# EAGLE design NTcounterTX (EAGLE 9.5.2)
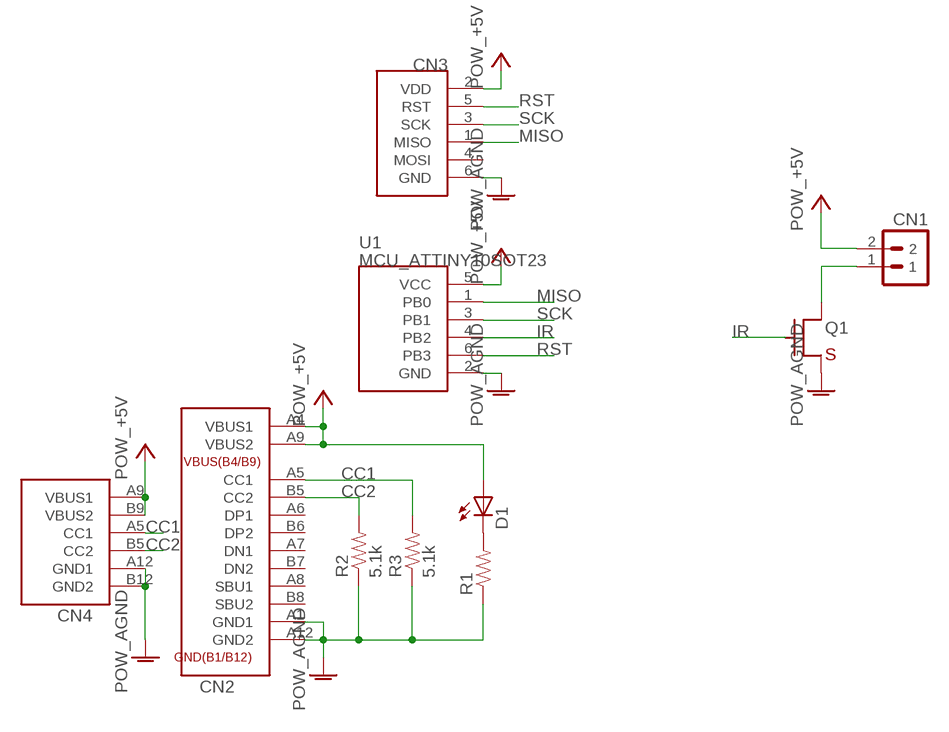
[diagram p0: schematic, sheet 1]

## Parts
CN1  CON_PINHD-1X2LOCK  [SPARKFUN_1X02_LOCK]
CN2  CON_USB-C-16TH  [USB-C_16P_TH]
CN3  CON_AVRISPTH  [2X03R]
CN4  CON_USB-C-6  [USB-C_6P]
D1  LED0603  [SPARKFUN_LED-0603]
Q1  TR_NMOS_IRLML6344  [SOT-23-3-2916]
R1  RES0603  [0603]
R2  5.1k  RES0603  [0603]
R3  5.1k  RES0603  [0603]
U1  MCU_ATTINY10SOT23  [SOT23-6]

## Nets
+5V: CN1.2 CN2.A4(VBUS1) CN2.A9(VBUS2) CN3.2(VDD) CN4.A9(VBUS1) CN4.B9(VBUS2) D1.A U1.5(VCC) ; supply symbol labelled POW_+5V
AGND: CN2.A1(GND1) CN2.A12(GND2) CN3.6(GND) CN4.A12(GND1) CN4.B12(GND2) Q1.2(S) R1.1 R2.1 R3.1 U1.2(GND) ; supply symbol labelled POW_AGND
CC1: CN2.A5(CC1) CN4.A5(CC1) R3.2
CC2: CN2.B5(CC2) CN4.B5(CC2) R2.2
IR: Q1.1(G) U1.4(PB2)
MISO: CN3.1(MISO) U1.1(PB0)
N$2: CN1.1 Q1.3(D)
N$3: D1.C R1.2
RST: CN3.5(RST) U1.6(PB3)
SCK: CN3.3(SCK) U1.3(PB1)
Unconnected: CN2.A6(DP1) CN2.A7(DN1) CN2.A8(SBU1) CN2.B6(DP2) CN2.B7(DN2) CN2.B8(SBU2) CN3.4(MOSI)

## Library data of the parts
CN1 = akita:CON_PINHD-1X2: Header 2 Standard 2-pin 0.1" header. Use with straight break away headers (SKU : PRT-00116), right angle break away headers (PRT-00553), swiss pins (PRT-00743), machine pins (PRT-00117), and female headers (PRT-00115). Molex polarized connector foot print use with SKU : PRT-08233 with associated crimp pins and housings.
CN2 = akita:CON_USB-C-16: USB Type-C, 16p with 8p dummy
CN3 = akita:CON_AVRISP: AVR ISP standard 2x3 connector
CN4 = akita:CON_USB-C-6: USB Type-C Receptacle, 6p (with 18p dummy), no D+/D-
D1 = akita:LED: LEDs Standard schematic elements and footprints for 5mm, 3mm, 1206, and 0603 sized LEDs. 5mm - Spark Fun Electronics SKU : COM-00529 (and others)
Q1 = akita:TR_NMOS_IRLML6344
R1-R3 = akita:RES: Resistor Basic schematic elements and footprints for 0603, 1206, and PTH resistors.
U1 = akita:MCU_ATTINY10

## Board
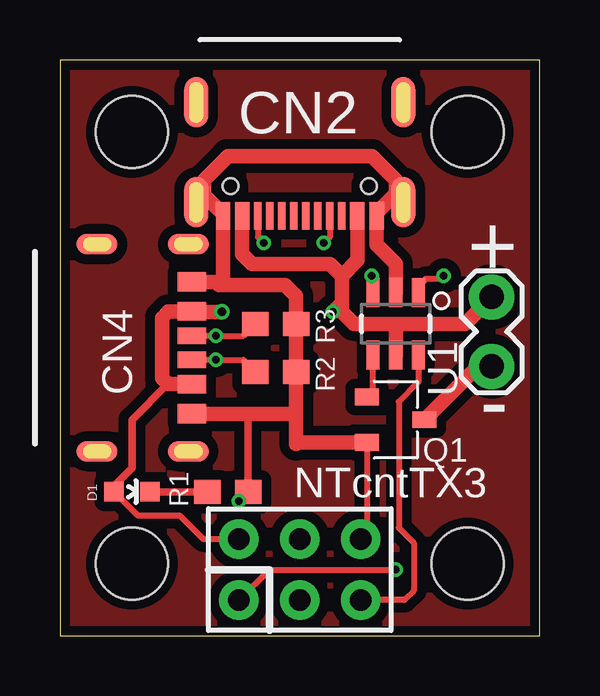
[diagram p1: board, top side]
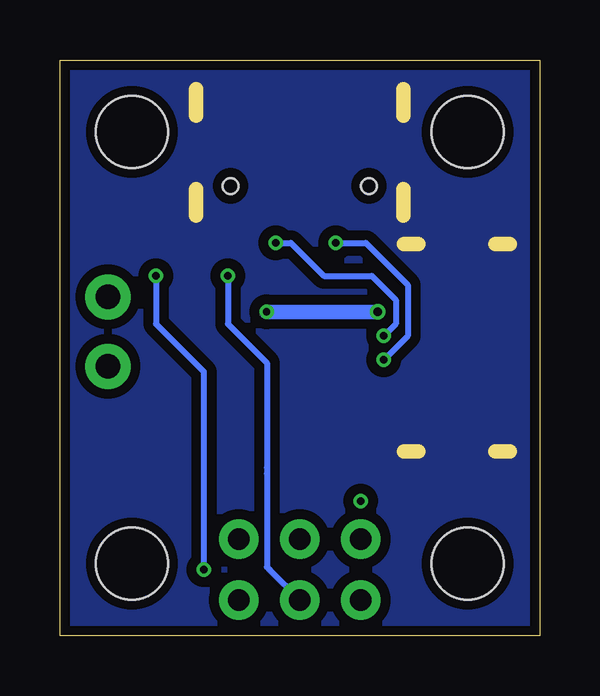
[diagram p2: board, bottom side, seen from below]

Size 20 x 24 mm. Coordinates in mm from the lower left corner, seen from the top.
Outline: 0,0 20,0 20,24 0,24 0,0
Copper layers (1*16): Top 0.035mm / dielectric 1.5mm / Bottom 0.035mm
Design rules "SeeedStudio_2layer_DRU_no_angle_20140221": minimum track width 6mil, minimum drill 12mil, track to track 6mil, track to pad 6mil, pad to pad 6mil, via to via 6mil, smd to smd 0mil, copper to edge 10mil, drill to drill 10mil, minimum pad ring 10mil, minimum via ring 6mil, stop-mask expansion 2mil, vias tented up to drill 100mil, thermal gap 10mil
Holes 3 mm at 3,3 17,3 17,21 3,21

### Footprints (pad centres in the part's own frame; a part is rotated, then mirrored left to right if it is on the bottom)
SPARKFUN_1X02_LOCK = drill 1.016 pad 1.88: 1 -0.178,0; 2 2.718,0
USB-C_16P_TH = smd 0.6 x 1.15: A1 -3.2,1; A4 -2.4,1; A9 2.4,1; A12 3.2,1 | smd 0.3 x 1.15: A5 -1.25,1; A6 -0.25,1; A7 0.25,1; A8 1.25,1; B5 1.75,1; B6 0.75,1; B7 -0.75,1; B8 -1.75,1 | smd 1 x 2.1: P$1 -4.32,0.435; P$2 -4.32,-3.735; P$3 4.32,0.435; P$4 4.32,-3.735 | hole 0.65: -2.89,-0.25; 2.89,-0.25
2X03R = drill 0.9 pad 1.651: 1 -2.54,-1.27; 2 -2.54,1.27; 3 0,-1.27; 4 0,1.27; 5 2.54,-1.27; 6 2.54,1.27
USB-C_6P = smd 0.7 x 1.2: A5 -0.5,3; B5 0.5,3 | smd 0.76 x 1.2: A9 1.52,3; B9 -1.52,3 | smd 0.8 x 1.2: A12 2.75,3; B12 -2.75,3 | smd 0.85 x 1.7: P$1 -4.32,2.85; P$2 -4.32,-0.95; P$3 4.32,2.85; P$4 4.32,-0.95
SPARKFUN_LED-0603 = smd 0.8 x 0.8: A 0,-0.75; C 0,0.75
SOT-23-3-2916 = smd 0.7 x 1: 1 -0.95,-1.2; 2 0.95,-1.2; 3 0,1.2
0603 = smd 1.1 x 1: 1 -0.85,0; 2 0.85,0
SOT23-6 = smd 0.55 x 1.2: 1 -0.95,-1.3; 2 0,-1.3; 3 0.95,-1.3; 4 0.95,1.3; 5 0,1.3; 6 -0.95,1.3

### Placement (x,y rotation side)
CN1  18,11.4 90 top
CN2  10,18.5 180 top
CN3  10,2.75 0 top
CN4  2.5,12 270 top
D1  3,6 270 top
Q1  14,9 270 top
R1  7,6 180 top
R2  9,11 180 top
R3  9,13 180 top
U1  14,13 180 top

### Tracks (layer width: path | path; a pad name or v marks a point on that pad's centre or on a via)
+5V  (via drill 0.3, 0.35)
  Top 0.254: CN3.2 5.98,4.02 5,5 3.25,5 D1.A
  Top 0.305: D1.A 2.25,6.25 3,7 3,9 4.48,10.48 4.52,10.48
  Top 0.61: CN2.A4 12.4,15.65 11.75,15 | 11.75,15 11.75,13.87 | 11.75,13.87 11.75,13.5 12.25,13 14,13 | 14,13 16.88,13 CN1.2 | U1.5 14,13 | CN2.A9 7.6,15.9 8,15.5 11.25,15.5 11.75,15 | v6.75,13.5 5.52,13.5 CN4.B9 4.52,13.52 4.25,13.25 4.25,10.75 4.52,10.48 CN4.A9 | 11.75,13.87 v11.38,13.5
  Bottom 0.61: v6.75,13.5 v11.38,13.5
AGND  (via drill 0.3)
  Top 0.254: v7.46,5.61 R1.1 | 12.8,4.28 Q1.2 12.8,4.28 | 12.8,4.28 CN3.6 12.8,4.28
  Top 0.305: R1.1 7.85,9.1 8,9.25
  Top 0.61: U1.2 14,15.5 13.2,16.3 CN2.A1 13.2,17.62 14,18.43 14,19 13,20 7,20 6,19 6,18.38 6.8,17.57 CN2.A12 6.8,14.8 6.75,14.75 | CN4.B12 6.75,14.75 | 9.85,9.25 R2.1 R3.1 9.85,14.15 9.38,14.62 6.62,14.62 6.75,14.75 | 9.85,9.25 9.85,8 9.9,8.05 Q1.2 | CN4.A12 8,9.25 9.85,9.25
CC1  (via drill 0.3)
  Top 0.254: R3.2 7.65,12.5 v6.5,12.5 CN4.A5 | CN2.A5 11.25,16.62 v11,16.38
  Bottom 0.254: v11,16.38 10.38,16.38 9,15 7,15 6,14 6,13 v6.5,12.5
CC2  (via drill 0.3)
  Top 0.254: R2.2 7.65,11.5 v6.5,11.5 CN4.B5 | CN2.B5 8.25,16.62 v8.5,16.38
  Bottom 0.254: v8.5,16.38 7.25,16.38 5.5,14.62 5.5,12.5 v6.5,11.5
GND
  pour Bottom (isolate 0.406): 0,24 20,24 20,0 0,0
IR
  Top 0.254: Q1.1 13.05,10.2 U1.4
MISO  (via drill 0.3)
  Top 0.254: v16,15 15.88,14.88 15.25,14.88 14.95,14.57 U1.1 | CN3.1 8.73,2.75 v14,2.75
  Bottom 0.254: v16,15 16,13 14,11 v14,2.75
N$1
  pour Top (isolate 0.406): 0,24 20,24 20,0 0,0
N$2
  Top 0.61: Q1.3 17.42,11.22 CN1.1
N$3
  Top 0.305: D1.C R1.2
RST
  Top 0.254: U1.6 14.95,10.57 14.12,9.75 14.12,4.5 14.75,3.88 14.75,1.88 14.36,1.48 CN3.5
SCK  (via drill 0.3)
  Top 0.254: U1.3 13,14.35 v13,15
  Bottom 0.254: CN3.3 11.26,2.74 11.38,2.85 11.38,6.75 11.38,7 11.38,11.38 13,13 v13,15

### Text on the board
tPlace: + | - | NTcntTX3